# EAGLE design STM32F446ZEJx-SW308-UFO V1.0 (EAGLE 9.6.2)
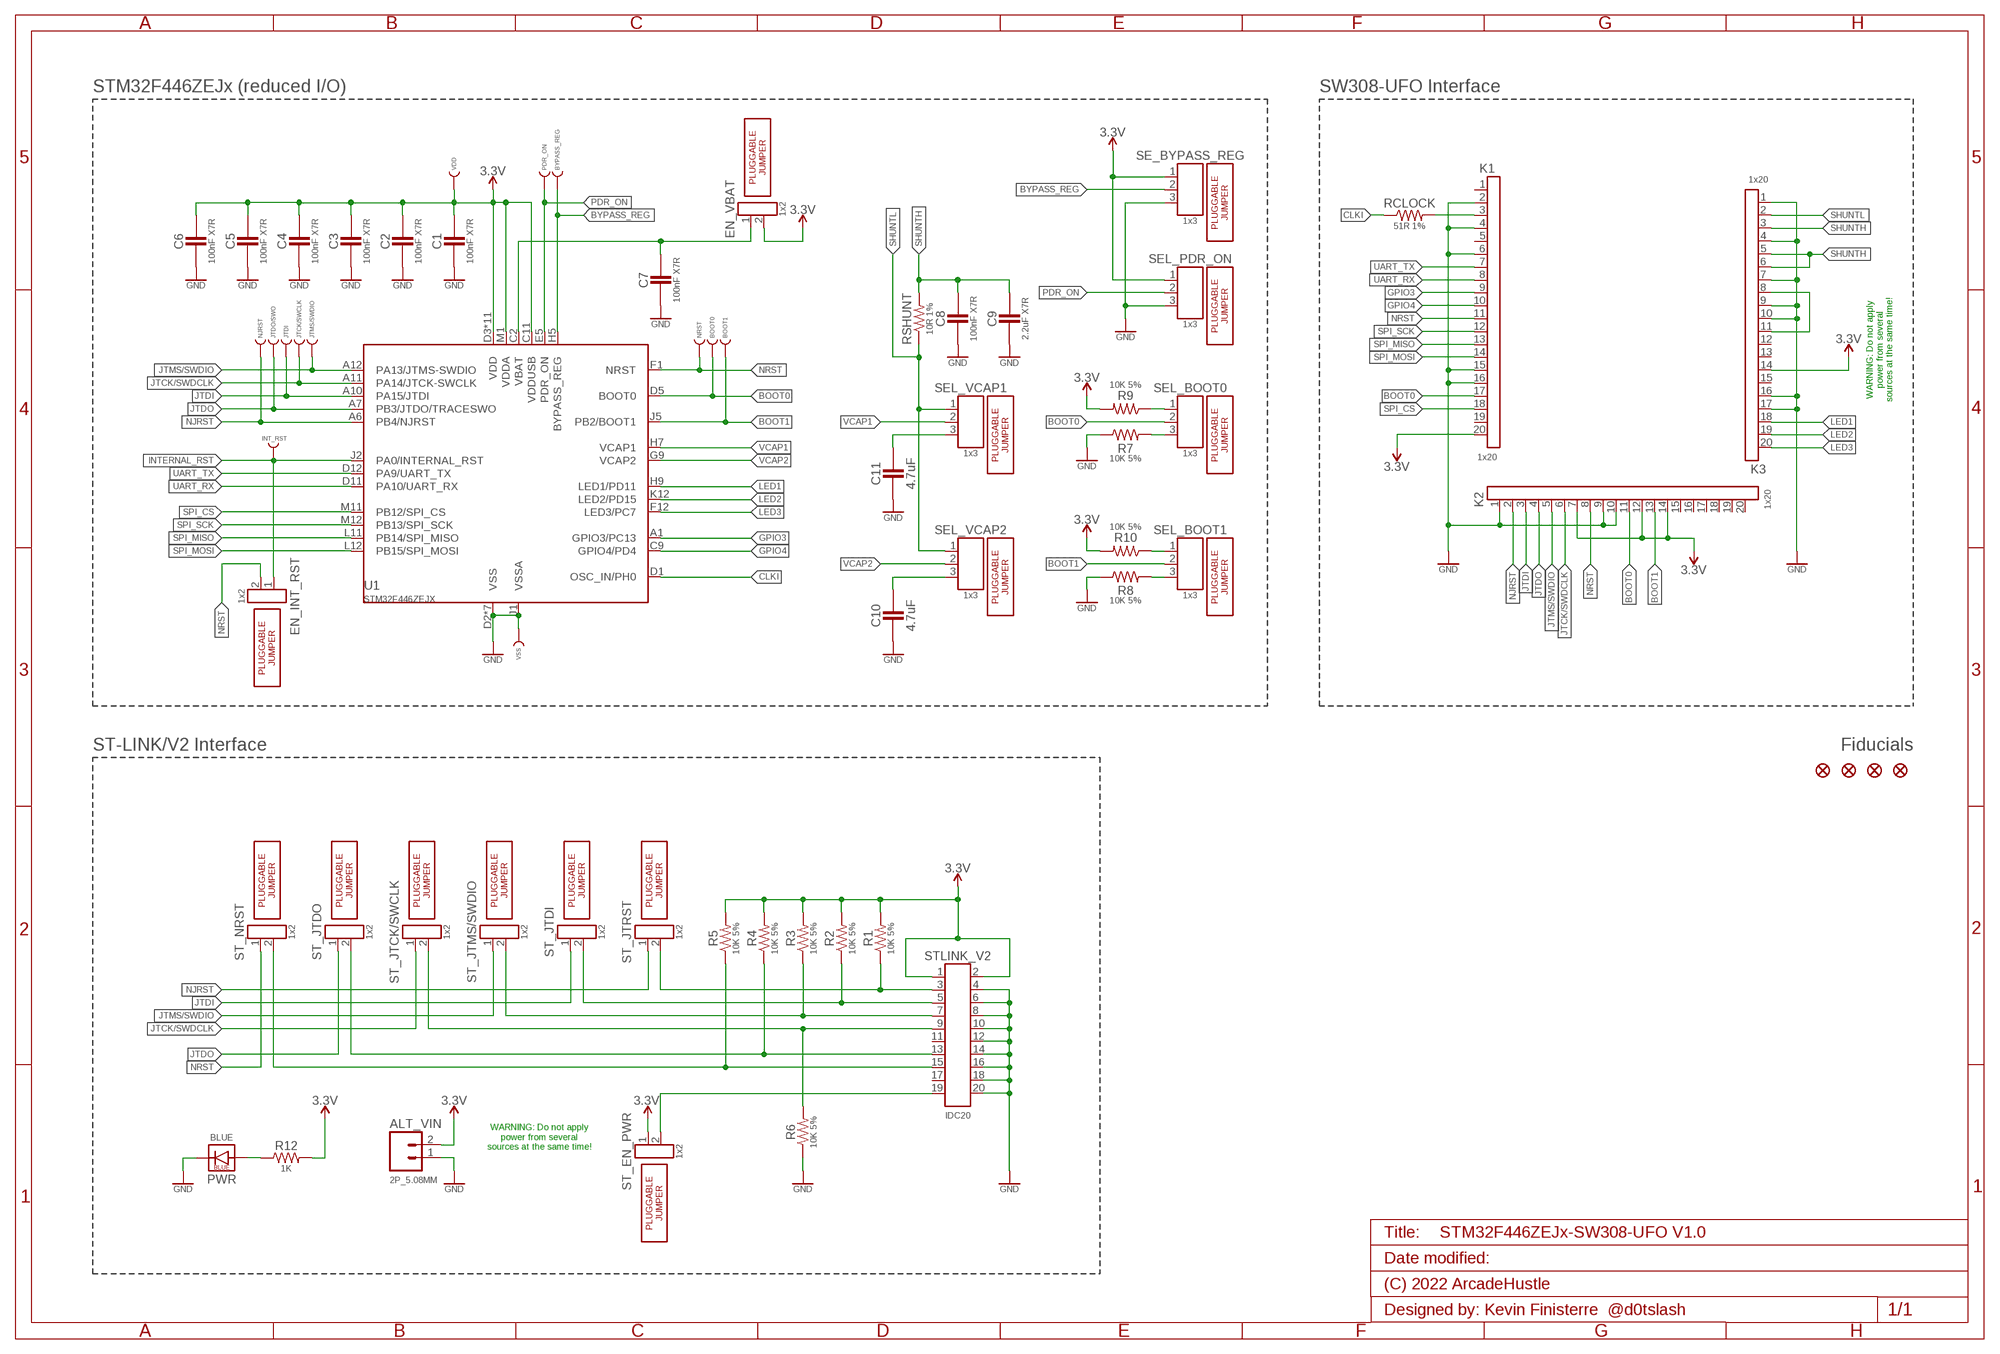
[diagram p0: schematic, sheet 1]

## Parts
ALT_VIN  2P_5.08MM  M02_BORNA_2X5.08MM_NINGBO-KANGNEX-ELEC_WJ500V-5.08-2P  [BORNA_2X5.08MM_NINGBO-KANGNEX-ELEC_WJ500V-5.08-2P]
BOOT0  TESTPOINT_TH_0.8MM  [1X01]
BOOT1  TESTPOINT_TH_0.8MM  [1X01]
BYPASS_REG  TESTPOINT_TH_0.8MM  [1X01]
C1  100nF X7R  CAP__0603_IPC_NOMINAL  [0603_IPC_NOMINAL]
C2  100nF X7R  CAP__0603_IPC_NOMINAL  [0603_IPC_NOMINAL]
C3  100nF X7R  CAP__0603_IPC_NOMINAL  [0603_IPC_NOMINAL]
C4  100nF X7R  CAP__0603_IPC_NOMINAL  [0603_IPC_NOMINAL]
C5  100nF X7R  CAP__0603_IPC_NOMINAL  [0603_IPC_NOMINAL]
C6  100nF X7R  CAP__0603_IPC_NOMINAL  [0603_IPC_NOMINAL]
C7  100nF X7R  CAP__0603_IPC_NOMINAL  [0603_IPC_NOMINAL]
C8  100nF X7R  CAP__0603_IPC_NOMINAL  [0603_IPC_NOMINAL]
C9  2.2uF X7R  CAP__0603_IPC_NOMINAL  [0603_IPC_NOMINAL]
C10  4.7uF  CAP__0603_IPC_NOMINAL  [0603_IPC_NOMINAL]
C11  4.7uF  CAP__0603_IPC_NOMINAL  [0603_IPC_NOMINAL]
EN_INT_RST  1x2  M1X2_GREENCONN_GPHA101-0201A001A1BA(A=6,B=3)_ALT_PADS  [M1X2_GREENCONN_GPHA101-0201A001A1BA(A=6,B=3)_ALT_PADS]
EN_VBAT  1x2  M1X2_GREENCONN_GPHA101-0201A001A1BA(A=6,B=3)_ALT_PADS  [M1X2_GREENCONN_GPHA101-0201A001A1BA(A=6,B=3)_ALT_PADS]
FD1  FIDUCIAL_MICRO  [FIDUCIAL-MICRO]
FD5  FIDUCIAL_MICRO  [FIDUCIAL-MICRO]
FD7  FIDUCIAL_MICRO  [FIDUCIAL-MICRO]
FD9  FIDUCIAL_MICRO  [FIDUCIAL-MICRO]
INT_RST  TESTPOINT_TH_0.8MM  [1X01]
JTCK/SWCLK  TESTPOINT_TH_0.8MM  [1X01]
JTDI  TESTPOINT_TH_0.8MM  [1X01]
JTDO/SWO  TESTPOINT_TH_0.8MM  [1X01]
JTMS/SWDIO  TESTPOINT_TH_0.8MM  [1X01]
JUMPER1  JUMPER_2.54MM  [JUMPER_2.54MM]
JUMPER2  JUMPER_2.54MM  [JUMPER_2.54MM]
JUMPER3  JUMPER_2.54MM  [JUMPER_2.54MM]
JUMPER4  JUMPER_2.54MM  [JUMPER_2.54MM]
JUMPER5  JUMPER_2.54MM  [JUMPER_2.54MM]
JUMPER6  JUMPER_2.54MM  [JUMPER_2.54MM]
JUMPER7  JUMPER_2.54MM  [JUMPER_2.54MM]
JUMPER8  JUMPER_2.54MM  [JUMPER_2.54MM]
JUMPER9  JUMPER_2.54MM  [JUMPER_2.54MM]
JUMPER10  JUMPER_2.54MM  [JUMPER_2.54MM]
JUMPER11  JUMPER_2.54MM  [JUMPER_2.54MM]
JUMPER12  JUMPER_2.54MM  [JUMPER_2.54MM]
JUMPER13  JUMPER_2.54MM  [JUMPER_2.54MM]
JUMPER14  JUMPER_2.54MM  [JUMPER_2.54MM]
JUMPER15  JUMPER_2.54MM  [JUMPER_2.54MM]
K1  1x20  M1X20_2.54MM_LOCK_BOOMELE_C50981  [M1X20_2.54MM_LOCK_BOOMELE_C50981]
K2  1x20  M1X20_2.54MM_LOCK_BOOMELE_C50981  [M1X20_2.54MM_LOCK_BOOMELE_C50981]
K3  1x20  M1X20_2.54MM_LOCK_BOOMELE_C50981  [M1X20_2.54MM_LOCK_BOOMELE_C50981]
NJRST  TESTPOINT_TH_0.8MM  [1X01]
NRST  TESTPOINT_TH_0.8MM  [1X01]
PDR_ON  TESTPOINT_TH_0.8MM  [1X01]
PWR  BLUE  DIODE-BLUE_0603  [0603-BLUE-LED]
R1  10K 5%  R_US_0603_IPC_NOMINAL  [0603_IPC_NOMINAL]
R2  10K 5%  R_US_0603_IPC_NOMINAL  [0603_IPC_NOMINAL]
R3  10K 5%  R_US_0603_IPC_NOMINAL  [0603_IPC_NOMINAL]
R4  10K 5%  R_US_0603_IPC_NOMINAL  [0603_IPC_NOMINAL]
R5  10K 5%  R_US_0603_IPC_NOMINAL  [0603_IPC_NOMINAL]
R6  10K 5%  R_US_0603_IPC_NOMINAL  [0603_IPC_NOMINAL]
R7  10K 5%  R_US_0603_IPC_NOMINAL  [0603_IPC_NOMINAL]
R8  10K 5%  R_US_0603_IPC_NOMINAL  [0603_IPC_NOMINAL]
R9  10K 5%  R_US_0603_IPC_NOMINAL  [0603_IPC_NOMINAL]
R10  10K 5%  R_US_0603_IPC_NOMINAL  [0603_IPC_NOMINAL]
R12  1K  R_US_0603_IPC_NOMINAL  [0603_IPC_NOMINAL]
RCLOCK  51R 1%  R_US_0603_IPC_NOMINAL  [0603_IPC_NOMINAL]
RSHUNT  10R 1%  R_US_0603_IPC_NOMINAL  [0603_IPC_NOMINAL]
SE_BYPASS_REG  1x3  M3_GREENCONN_GPHA101-0301A001A1BA(A=6,B=3)_ALT_PADS  [M1X3_GREENCONN_GPHA101-0301A001A1BA(A=6,B=3)_ALT_PADS]
SEL_BOOT0  1x3  M3_GREENCONN_GPHA101-0301A001A1BA(A=6,B=3)_ALT_PADS  [M1X3_GREENCONN_GPHA101-0301A001A1BA(A=6,B=3)_ALT_PADS]
SEL_BOOT1  1x3  M3_GREENCONN_GPHA101-0301A001A1BA(A=6,B=3)_ALT_PADS  [M1X3_GREENCONN_GPHA101-0301A001A1BA(A=6,B=3)_ALT_PADS]
SEL_PDR_ON  1x3  M3_GREENCONN_GPHA101-0301A001A1BA(A=6,B=3)_ALT_PADS  [M1X3_GREENCONN_GPHA101-0301A001A1BA(A=6,B=3)_ALT_PADS]
SEL_VCAP1  1x3  M3_GREENCONN_GPHA101-0301A001A1BA(A=6,B=3)_ALT_PADS  [M1X3_GREENCONN_GPHA101-0301A001A1BA(A=6,B=3)_ALT_PADS]
SEL_VCAP2  1x3  M3_GREENCONN_GPHA101-0301A001A1BA(A=6,B=3)_ALT_PADS  [M1X3_GREENCONN_GPHA101-0301A001A1BA(A=6,B=3)_ALT_PADS]
ST_EN_PWR  1x2  M1X2_GREENCONN_GPHA101-0201A001A1BA(A=6,B=3)_ALT_PADS  [M1X2_GREENCONN_GPHA101-0201A001A1BA(A=6,B=3)_ALT_PADS]
ST_JTCK/SWCLK  1x2  M1X2_GREENCONN_GPHA101-0201A001A1BA(A=6,B=3)_ALT_PADS  [M1X2_GREENCONN_GPHA101-0201A001A1BA(A=6,B=3)_ALT_PADS]
ST_JTDI  1x2  M1X2_GREENCONN_GPHA101-0201A001A1BA(A=6,B=3)_ALT_PADS  [M1X2_GREENCONN_GPHA101-0201A001A1BA(A=6,B=3)_ALT_PADS]
ST_JTDO  1x2  M1X2_GREENCONN_GPHA101-0201A001A1BA(A=6,B=3)_ALT_PADS  [M1X2_GREENCONN_GPHA101-0201A001A1BA(A=6,B=3)_ALT_PADS]
ST_JTMS/SWDIO  1x2  M1X2_GREENCONN_GPHA101-0201A001A1BA(A=6,B=3)_ALT_PADS  [M1X2_GREENCONN_GPHA101-0201A001A1BA(A=6,B=3)_ALT_PADS]
ST_JTRST  1x2  M1X2_GREENCONN_GPHA101-0201A001A1BA(A=6,B=3)_ALT_PADS  [M1X2_GREENCONN_GPHA101-0201A001A1BA(A=6,B=3)_ALT_PADS]
ST_NRST  1x2  M1X2_GREENCONN_GPHA101-0201A001A1BA(A=6,B=3)_ALT_PADS  [M1X2_GREENCONN_GPHA101-0201A001A1BA(A=6,B=3)_ALT_PADS]
STLINK_V2  IDC20  M2X10_2.54MM_IDC_SHROUDED__JLIN_321020SG0ABK00A01_C429961  [M2X10_2.54MM_IDC_SHROUDED__JLIN_321020SG0ABK00A01_C429961]
U1  STM32F446ZEJX  STM32F446ZEJX_MINIMUM2_UFBGA144  [STM32F446ZEJX]
VDD  TESTPOINT_TH_0.8MM  [1X01]
VSS  TESTPOINT_TH_0.8MM  [1X01]

## Nets
3.3V: ALT_VIN.2 C1.1 C2.1 C3.1 C4.1 C5.1 C6.1 EN_VBAT.2 K1.20 K2.7 K2.12 K2.14 K3.14 R1.2 R2.2 R3.2 R4.2 R5.2 R9.2 R10.2 R12.2 SE_BYPASS_REG.1 SEL_PDR_ON.1 ST_EN_PWR.1 STLINK_V2.1 STLINK_V2.2 U1.C11(VDDUSB) U1.D3(VDD) U1.F4(VDD) U1.F5(VDD) U1.F6(VDD) U1.F7(VDD) U1.F8(VDD) U1.F9(VDD) U1.F10(VDD) U1.G5(VDD) U1.G6(VDD) U1.G7(VDD) U1.M1(VDDA) VDD.1
BOOT0: BOOT0.1 K1.17 K2.11 SEL_BOOT0.2 U1.D5(BOOT0)
BOOT1: BOOT1.1 K2.13 SEL_BOOT1.2 U1.J5(PB2/BOOT1)
BYPASS_REG: BYPASS_REG.1 SE_BYPASS_REG.2 U1.H5(BYPASS_REG)
CLKI: RCLOCK.1 U1.D1(OSC_IN/PH0)
GND: ALT_VIN.1 C1.2 C2.2 C3.2 C4.2 C5.2 C6.2 C7.2 C8.2 C9.2 C10.2 C11.2 K1.2 K1.4 K1.6 K1.15 K1.16 K2.1 K2.9 K2.10 K3.1 K3.4 K3.7 K3.9 K3.10 K3.16 K3.17 PWR.CATHODE(C) R6.1 R7.1 R8.1 SE_BYPASS_REG.3 SEL_PDR_ON.3 STLINK_V2.4 STLINK_V2.6 STLINK_V2.8 STLINK_V2.10 STLINK_V2.12 STLINK_V2.14 STLINK_V2.16 STLINK_V2.18 STLINK_V2.20 U1.D2(VSS) U1.E6(VSS) U1.E7(VSS) U1.G4(VSS) U1.G8(VSS) U1.G10(VSS) U1.H6(VSS) U1.J1(VSSA) VSS.1
GPIO3: K1.9 U1.A1(GPIO3/PC13)
GPIO4: K1.10 U1.C9(GPIO4/PD4)
INTERNAL_RST: EN_INT_RST.1 INT_RST.1 U1.J2(PA0/INTERNAL_RST)
JTCK/SWDCLK: JTCK/SWCLK.1 K2.6 ST_JTCK/SWCLK.1 U1.A11(PA14/JTCK-SWCLK)
JTDI: JTDI.1 K2.3 ST_JTDI.1 U1.A10(PA15/JTDI)
JTDO: JTDO/SWO.1 K2.4 ST_JTDO.1 U1.A7(PB3/JTDO/TRACESWO)
JTMS/SWDIO: JTMS/SWDIO.1 K2.5 ST_JTMS/SWDIO.1 U1.A12(PA13/JTMS-SWDIO)
LED1: K3.18 U1.H9(LED1/PD11)
LED2: K3.19 U1.K12(LED2/PD15)
LED3: K3.20 U1.F12(LED3/PC7)
N$1: R2.1 ST_JTDI.2 STLINK_V2.5
N$2: C7.1 EN_VBAT.1 U1.C2(VBAT)
N$3: PWR.ANODE(A) R12.1
N$4: R3.1 ST_JTMS/SWDIO.2 STLINK_V2.7
N$5: C10.1 SEL_VCAP2.3
N$6: R1.1 ST_JTRST.2 STLINK_V2.3
N$7: R6.2 ST_JTCK/SWCLK.2 STLINK_V2.9
N$8: R7.2 SEL_BOOT0.3
N$9: R4.1 ST_JTDO.2 STLINK_V2.13
N$10: R10.1 SEL_BOOT1.1
N$11: R5.1 ST_NRST.2 STLINK_V2.15
N$12: R8.2 SEL_BOOT1.3
N$13: ST_EN_PWR.2 STLINK_V2.19
N$14: C11.1 SEL_VCAP1.3
N$15: R9.1 SEL_BOOT0.1
N$18: K3.8 K3.11
N$19: K1.3 RCLOCK.2
NJRST: K2.2 NJRST.1 ST_JTRST.1 U1.A6(PB4/NJRST)
NRST: EN_INT_RST.2 K1.11 K2.8 NRST.1 ST_NRST.1 U1.F1(NRST)
PDR_ON: PDR_ON.1 SEL_PDR_ON.2 U1.E5(PDR_ON)
SHUNTH: C8.1 C9.1 K3.3 K3.5 K3.6 RSHUNT.2
SHUNTL: K3.2 RSHUNT.1 SEL_VCAP1.1 SEL_VCAP2.1
SPI_CS: K1.18 U1.M11(PB12/SPI_CS)
SPI_MISO: K1.13 U1.L11(PB14/SPI_MISO)
SPI_MOSI: K1.14 U1.L12(PB15/SPI_MOSI)
SPI_SCK: K1.12 U1.M12(PB13/SPI_SCK)
UART_RX: K1.8 U1.D11(PA10/UART_RX)
UART_TX: K1.7 U1.D12(PA9/UART_TX)
VCAP1: SEL_VCAP1.2 U1.H7(VCAP1)
VCAP2: SEL_VCAP2.2 U1.G9(VCAP2)
Unconnected: K1.1 K1.5 K1.19 K2.15 K2.16 K2.17 K2.18 K2.19 K2.20 K3.12 K3.13 K3.15 STLINK_V2.11 STLINK_V2.17

## Notes on the sheet
- STM32F446ZEJx (reduced I/O) | SW308-UFO Interface
- WARNING: Do not apply
  power from several
  sources at the same time!
- ST-LINK/V2 Interface | Fiducials
- WARNING: Do not apply
  power from several
  sources at the same time!

## Library data of the parts
ALT_VIN = ArcadeHustle:M02; ALT_LCSC_PN: C8269; ALT_MANUFACTURER: Ningbo Kangnex Elec; ALT_PN: WJ128V-5.0-2P; LCSC_PN: C8465; MANUFACTURER: Ningbo Kangnex Elec; PN: WJ500V-5.08-2P
BOOT0 BOOT1 BYPASS_REG INT_RST JTCK/SWCLK JTDI JTDO/SWO JTMS/SWDIO NJRST NRST PDR_ON VDD VSS = ArcadeHustle:TESTPOINT
C1-C8 = ArcadeHustle:CAP_; LCSC_PN: C1591; MANUFACTURER: Samsung Electro-Mechanics; PN: CL10B104KB8NNNC
C9 = ArcadeHustle:CAP_; LCSC_PN: C100082; MANUFACTURER: Samsung Electro-Mechanics; PN: CL10B225KP8NNNC
C10 C11 = ArcadeHustle:CAP_; LCSC_PN: C8032; MANUFACTURER: Samsung Electro-Mechanics; PN: CL10A475KQ8NNNC
EN_INT_RST EN_VBAT ST_EN_PWR ST_JTCK/SWCLK ST_JTDI ST_JTDO ST_JTMS/SWDIO ST_JTRST ST_NRST = ArcadeHustle:M1X2; ALT_LCSC_PN: -; ALT_MANUFACTURER: GREENCONN; ALT_PN: GPHA101-0201A001A1BA(A=6,B=3); LCSC_PN: C124375; MANUFACTURER: Ckmtw(Shenzhen Cankemeng); PN: C124375
FD1 FD5 FD7 FD9 = ArcadeHustle:FIDUCIAL
JUMPER1-JUMPER15 = ArcadeHustle:JUMPER; LCSC_PN: C5305; MANUFACTURER: BOOMELE(Boom Precision Elec); PN: C5305
K1-K3 = ArcadeHustle:M1X20; LCSC_PN: C50981; MANUFACTURER: BOOMELE(Boom Precision Elec); PN: C50981
PWR = ArcadeHustle:DIODE-BLUE; LCSC_PN: C72041; MANUFACTURER: Everlight Elec; PN: 19-217/BHC-ZL1M2RY/3T
R1-R10 = ArcadeHustle:R_US_; LCSC_PN: C99198; MANUFACTURER: YAGEO; PN: RC0603JR-0710KL
R12 = ArcadeHustle:R_US_; LCSC_PN: C22548; MANUFACTURER: YAGEO; PN: RC0603FR-071KL
RCLOCK = ArcadeHustle:R_US_; LCSC_PN: C114628; MANUFACTURER: YAGEO; PN: RC0603FR-0751RL
RSHUNT = ArcadeHustle:R_US_; LCSC_PN: C109318; MANUFACTURER: YAGEO; PN: RC0603FR-0710RL
SE_BYPASS_REG SEL_BOOT0 SEL_BOOT1 SEL_PDR_ON SEL_VCAP1 SEL_VCAP2 = ArcadeHustle:M3; ALT_LCSC_PN: -; ALT_MANUFACTURER: GREENCONN; ALT_PN: GPHA101-0301A001A1BA(A=6,B=3); LCSC_PN: C49257; MANUFACTURER: BOOMELE(Boom Precision Elec); PN: C49257
STLINK_V2 = ArcadeHustle:M2X10; ALT2_LCSC_PN: -; ALT2_MANUFACTURER: GREENCONN; ALT2_PN: GPHA204-1001A001A1SB(B=3); ALT_LCSC_PN: C19694; ALT_MANUFACTURER: BOOMELE(Boom Precision Elec); ALT_PN: C19694; LCSC_PN: C429961; MANUFACTURER: JLIN; PN: 321020SG0ABK00A01
U1 = ArcadeHustle:STM32F446ZEJX_MINIMUM2

## Net classes
0 default_50R_L1-L2: width 0.089 mm, drill 0.2 mm, clearance 0.114 mm
1 PWR: width 0.3 mm, drill 0.2 mm, clearance 0.114 mm
2 MICROSTRIP_50R_L1-L2: width 0.147 mm, drill 0.2 mm, clearance 0.147 mm to class 0, clearance 0.147 mm to class 1, clearance 0.147 mm
3 MICROSTRIP_90R-DIFF_S1=8mils_L1-L2: width 0.153 mm, drill 0.2 mm, clearance 0.203 mm
4 COPLANAR_WAVEGUIDE_LINE_50R-L1-L3: width 0.8 mm, drill 0.2 mm, clearance 0.176 mm to class 0, clearance 0.176 mm to class 1
5 MICROSTRIP_90R-DIFF_S1=5mils_L1-L2: width 0.131 mm, drill 0.2 mm, clearance 0.305 mm to class 0, clearance 0.305 mm to class 1, clearance 0.127 mm

## Board
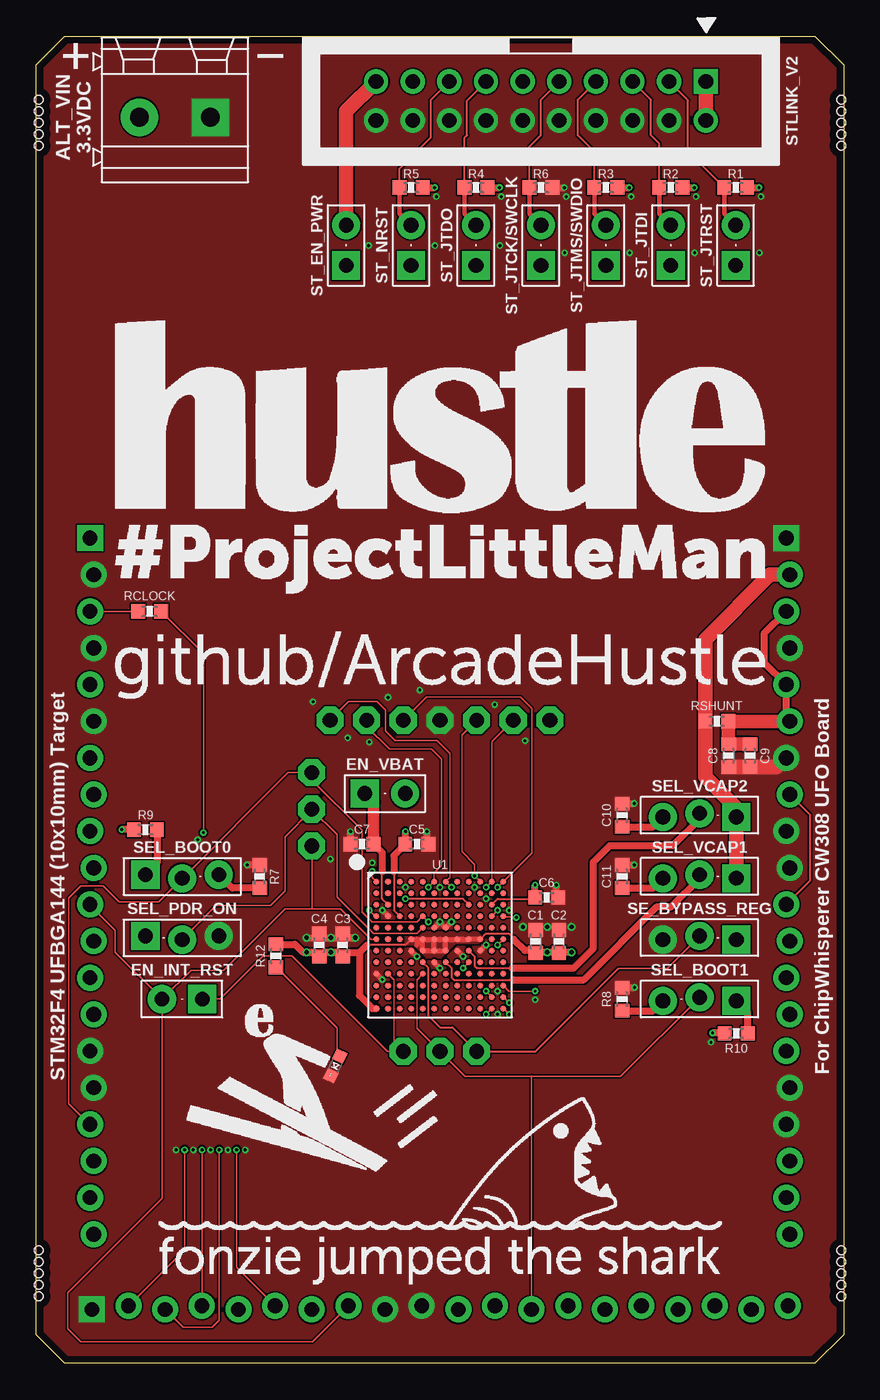
[diagram p1: board, top side]
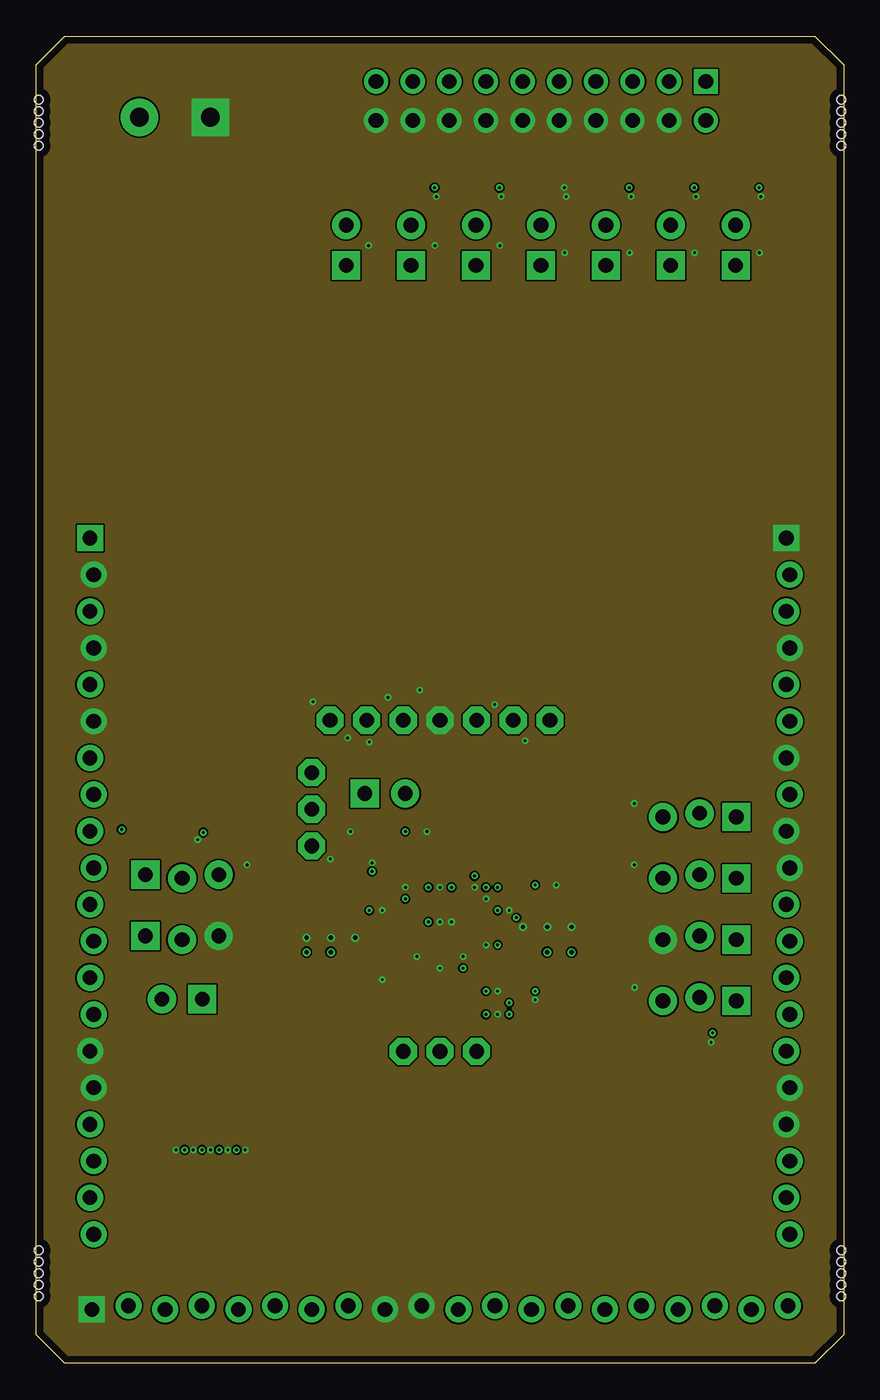
[diagram p2: board, inner layer GND1]
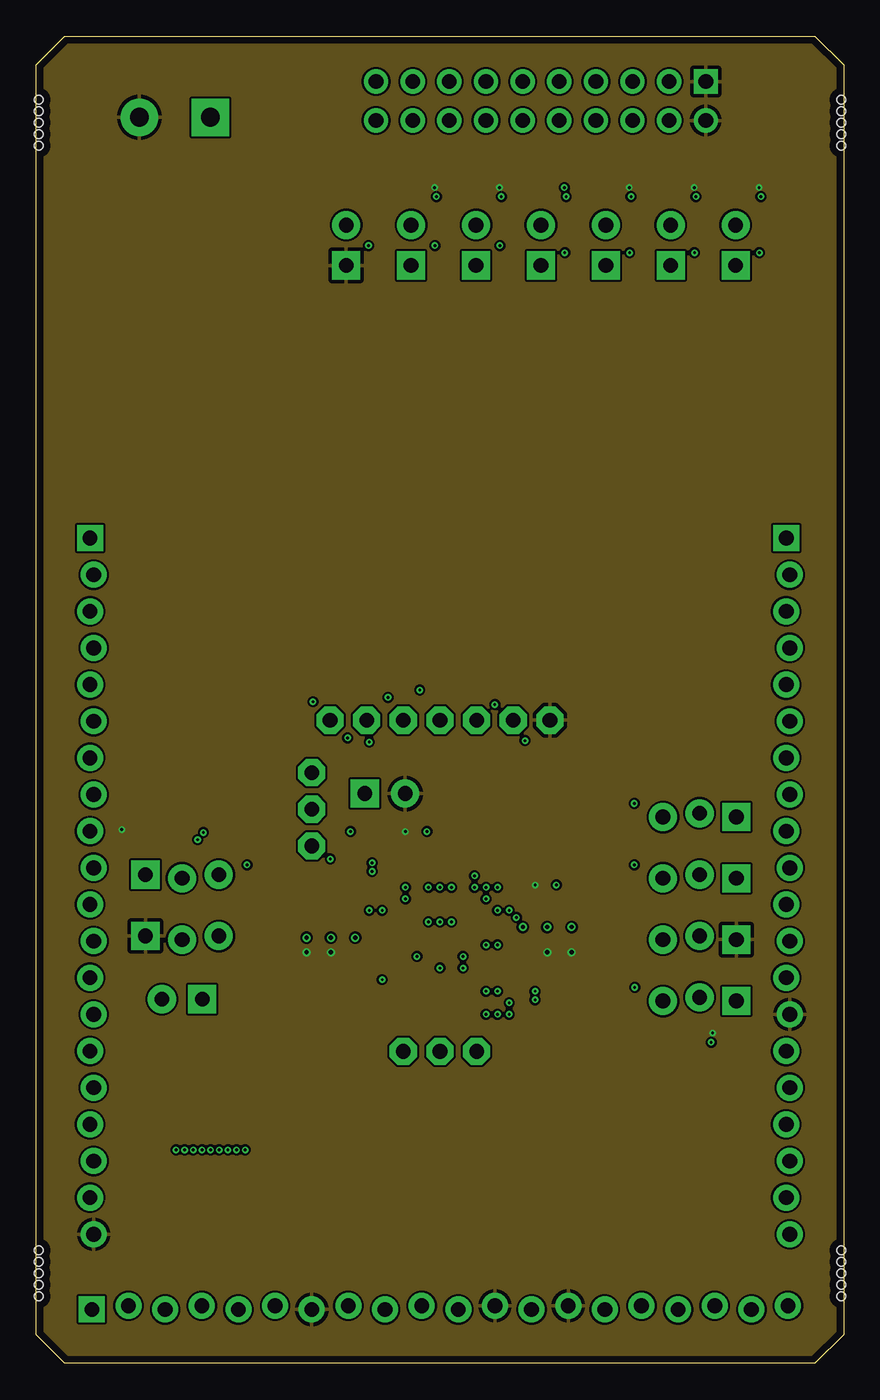
[diagram p3: board, inner layer PWR]
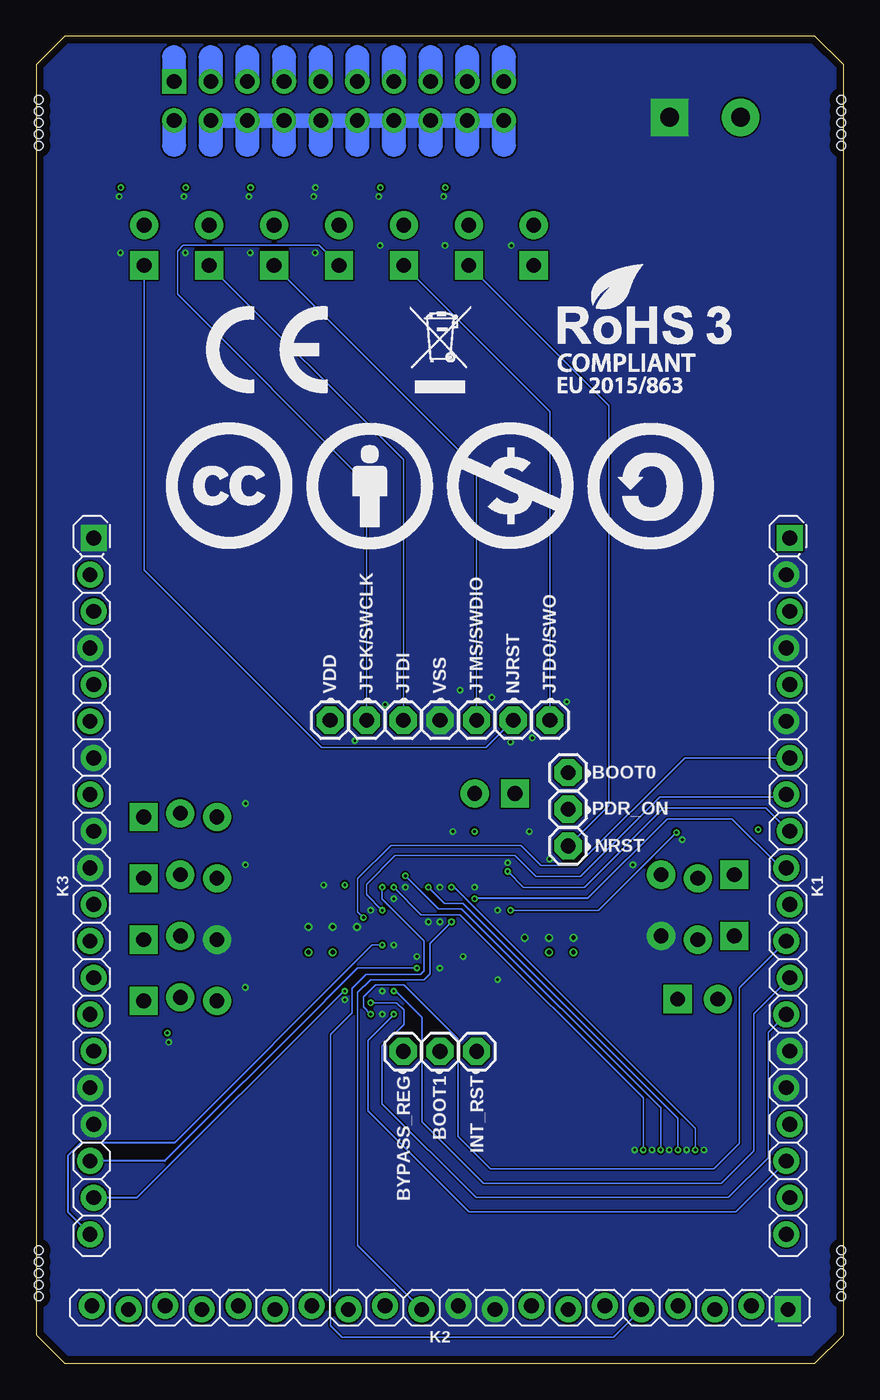
[diagram p4: board, bottom side, seen from below]

Size 56 x 92 mm. Coordinates in mm from the lower left corner, seen from the top.
Outline: 2,0 0,2 0,90 2,92 54,92 56,90 56,2 54,0 2,0
Copper layers (1+2*15+16): TOP(SIGNAL) 0.035mm / dielectric 0.1mm / GND1 0.0175mm / dielectric 1.295mm / PWR 0.0175mm / dielectric 0.1mm / BOTTOM(SIGNAL) 0.035mm
Design rules "7IX_SDRAM_128MB v1.1 *": minimum track width 3.5mil, minimum drill 0.2mm, track to track 4.5mil, track to pad 4.5mil, pad to pad 4.5mil, via to via 4.5mil, smd to smd 4.5mil, copper to edge 0.5mm, drill to drill 8mil, minimum pad ring 5mil, minimum via ring 5mil, stop-mask expansion 1mil, vias tented up to drill 0.3mm, thermal gap 10mil
Holes 3.13 mm at -4.5,6 60.5,6 60.5,86 -4.5,86
Holes 0.6 mm at 0.19,86 0.19,85.2 0.19,84.4 0.19,86.8 0.19,87.6 0.19,6.25 0.19,5.45 0.19,4.65 0.19,7.05 0.19,7.85 55.81,86 55.81,85.2 55.81,84.4 55.81,86.8 55.81,87.6 55.81,6.25 55.81,5.45 55.81,4.65 55.81,7.05 55.81,7.85

### Footprints (pad centres in the part's own frame; a part is rotated, then mirrored left to right if it is on the bottom)
BORNA_2X5.08MM_NINGBO-KANGNEX-ELEC_WJ500V-5.08-2P = drill 1.3 pad 2.6 square: 1 -2.46,0 | drill 1.3 pad 2.6: 2 2.46,0
1X01 = drill 1.016 pad 1.88 octagon: 1 0,0
0603_IPC_NOMINAL = smd 0.95 x 1: 1 -0.8,0; 2 0.8,0
M1X2_GREENCONN_GPHA101-0201A001A1BA(A=6,B=3)_ALT_PADS = drill 1.02 pad 1.95 square: 1 -1.397,0 | drill 1.02 pad 1.95: 2 1.397,0
FIDUCIAL-MICRO = smd 0.635 x 0.635: 1 0,0
M1X20_2.54MM_LOCK_BOOMELE_C50981 = drill 1.02 pad 1.8 square: 1 -24.13,0.127 | drill 1.02 pad 1.8: 2 -21.59,-0.127; 3 -19.05,0.127; 4 -16.51,-0.127; 5 -13.97,0.127; 6 -11.43,-0.127; 7 -8.89,0.127; 8 -6.35,-0.127; 9 -3.81,0.127; 10 -1.27,-0.127; 11 1.27,0.127; 12 3.81,-0.127; 13 6.35,0.127; 14 8.89,-0.127; 15 11.43,0.127; 16 13.97,-0.127; 17 16.51,0.127; 18 19.05,-0.127; 19 21.59,0.127; 20 24.13,-0.127
0603-BLUE-LED = smd 0.8 x 0.8: ANODE -0.75,0; CATHODE 0.75,0
M1X3_GREENCONN_GPHA101-0301A001A1BA(A=6,B=3)_ALT_PADS = drill 1.02 pad 1.95 square: 1 -2.54,0.127 | drill 1.02 pad 1.95: 2 0,-0.127; 3 2.54,0.127
M2X10_2.54MM_IDC_SHROUDED__JLIN_321020SG0ABK00A01_C429961 = drill 1.016 pad 1.676 square: 1 -11.43,-1.35 | drill 1.016 pad 1.676: 2 -11.43,1.35; 3 -8.89,-1.35; 4 -8.89,1.35; 5 -6.35,-1.35; 6 -6.35,1.35; 7 -3.81,-1.35; 8 -3.81,1.35; 9 -1.27,-1.35; 10 -1.27,1.35; 11 1.27,-1.35; 12 1.27,1.35; 13 3.81,-1.35; 14 3.81,1.35; 15 6.35,-1.35; 16 6.35,1.35; 17 8.89,-1.35; 18 8.89,1.35; 19 11.43,-1.35; 20 11.43,1.35
STM32F446ZEJX = smd 0.4 x 0.4: A1 -4.4,4.4; A2 -3.6,4.4; A3 -2.8,4.4; A4 -2,4.4; A5 -1.2,4.4; A6 -0.4,4.4; A7 0.4,4.4; A8 1.2,4.4; A9 2,4.4; A10 2.8,4.4; A11 3.6,4.4; A12 4.4,4.4; B1 -4.4,3.6; B2 -3.6,3.6; B3 -2.8,3.6; B4 -2,3.6; B5 -1.2,3.6; B6 -0.4,3.6; B7 0.4,3.6; B8 1.2,3.6; B9 2,3.6; B10 2.8,3.6; B11 3.6,3.6; B12 4.4,3.6; C1 -4.4,2.8; C2 -3.6,2.8; C3 -2.8,2.8; C4 -2,2.8; C5 -1.2,2.8; C6 -0.4,2.8; C7 0.4,2.8; C8 1.2,2.8; C9 2,2.8; C10 2.8,2.8; C11 3.6,2.8; C12 4.4,2.8; D1 -4.4,2; D2 -3.6,2; D3 -2.8,2; D4 -2,2; D5 -1.2,2; D6 -0.4,2; D7 0.4,2; D8 1.2,2; D9 2,2; D10 2.8,2; D11 3.6,2; D12 4.4,2; E1 -4.4,1.2; E2 -3.6,1.2; E3 -2.8,1.2; E4 -2,1.2; E5 -1.2,1.2; E6 -0.4,1.2; E7 0.4,1.2; E8 1.2,1.2; E9 2,1.2; E10 2.8,1.2; E11 3.6,1.2; E12 4.4,1.2; F1 -4.4,0.4; F2 -3.6,0.4; F3 -2.8,0.4; F4 -2,0.4; F5 -1.2,0.4; F6 -0.4,0.4; F7 0.4,0.4; F8 1.2,0.4; F9 2,0.4; F10 2.8,0.4; F11 3.6,0.4; F12 4.4,0.4; G1 -4.4,-0.4; G2 -3.6,-0.4; G3 -2.8,-0.4; G4 -2,-0.4; G5 -1.2,-0.4; G6 -0.4,-0.4; G7 0.4,-0.4; G8 1.2,-0.4; G9 2,-0.4; G10 2.8,-0.4; G11 3.6,-0.4; G12 4.4,-0.4; H1 -4.4,-1.2; H2 -3.6,-1.2; H3 -2.8,-1.2; H4 -2,-1.2; H5 -1.2,-1.2; H6 -0.4,-1.2; H7 0.4,-1.2; H8 1.2,-1.2; H9 2,-1.2; H10 2.8,-1.2; H11 3.6,-1.2; H12 4.4,-1.2; J1 -4.4,-2; J2 -3.6,-2; J3 -2.8,-2; J4 -2,-2; J5 -1.2,-2; J6 -0.4,-2; J7 0.4,-2; J8 1.2,-2; J9 2,-2; J10 2.8,-2; J11 3.6,-2; J12 4.4,-2; K1 -4.4,-2.8; K2 -3.6,-2.8; K3 -2.8,-2.8; K4 -2,-2.8; K5 -1.2,-2.8; K6 -0.4,-2.8; K7 0.4,-2.8; K8 1.2,-2.8; K9 2,-2.8; K10 2.8,-2.8; K11 3.6,-2.8; K12 4.4,-2.8; L1 -4.4,-3.6; L2 -3.6,-3.6; L3 -2.8,-3.6; L4 -2,-3.6; L5 -1.2,-3.6; L6 -0.4,-3.6; L7 0.4,-3.6; L8 1.2,-3.6; L9 2,-3.6; L10 2.8,-3.6; L11 3.6,-3.6; L12 4.4,-3.6; M1 -4.4,-4.4; M2 -3.6,-4.4; M3 -2.8,-4.4; M4 -2,-4.4; M5 -1.2,-4.4; M6 -0.4,-4.4; M7 0.4,-4.4; M8 1.2,-4.4; M9 2,-4.4; M10 2.8,-4.4; M11 3.6,-4.4; M12 4.4,-4.4

### Placement (x,y rotation side)
ALT_VIN  9.62,86.38 180 top
BOOT0  19.11,40.95 180 bottom
BOOT1  28,21.62 90 bottom
BYPASS_REG  30.54,21.62 90 bottom
C1  34.62,29.25 90 top
C2  36.25,29.25 90 top
C3  21.25,29 90 top
C4  19.62,29 90 top
C5  26.4,36 0 top
C6  35.4,32.3 0 top
C7  22.6,36 180 top
C8  48,42.12 270 top
C9  49.5,42.12 270 top
C10  40.62,38 90 top
C11  40.62,33.75 90 top
EN_INT_RST  10.12,25.25 180 top
EN_VBAT  24.19,39.5 0 top
FD1  -4.5,82 0 top  (outside the outline)
FD5  -4.5,10 0 top  (outside the outline)
FD7  60.5,10 0 top  (outside the outline)
FD9  60.5,82 0 top  (outside the outline)
INT_RST  25.46,21.62 90 bottom
JTCK/SWCLK  33.08,44.58 270 bottom
JTDI  30.54,44.58 270 bottom
JTDO/SWO  20.38,44.58 270 bottom
JTMS/SWDIO  25.46,44.58 270 bottom
JUMPER1  21.5,77.5 90 top
JUMPER2  26,77.5 90 top
JUMPER3  30.5,77.5 90 top
JUMPER4  35,77.5 90 top
JUMPER5  39.5,77.5 270 top
JUMPER6  44,77.5 90 top
JUMPER7  48.5,77.5 90 top
JUMPER8  47.27,29.5 180 top
JUMPER9  10.12,25.25 0 top
JUMPER10  8.86,29.5 0 top
JUMPER11  47.27,33.75 180 top
JUMPER12  44.73,25.25 0 top
JUMPER13  47.27,38 0 top
JUMPER14  11.39,33.75 0 top
JUMPER15  24.19,39.5 0 top
K1  3.87,33.08 270 bottom
K2  28,3.87 180 bottom
K3  52.13,33.08 270 bottom
NJRST  22.92,44.58 270 bottom
NRST  19.11,35.87 180 bottom
PDR_ON  19.11,38.41 180 bottom
PWR  20.75,20.62 245 top
R1  48.5,81.5 0 top
R2  44,81.5 0 top
R3  39.5,81.5 0 top
R4  30.5,81.5 0 top
R5  26,81.5 0 top
R6  35,81.5 180 top
R7  15.5,33.75 270 top
R8  40.62,25.25 270 top
R9  7.58,37 180 top
R10  48.54,22.88 180 top
R12  16.62,28.25 90 top
RCLOCK  7.88,52.12 180 top
RSHUNT  47.19,44.51 0 top
SE_BYPASS_REG  46,29.5 180 top
SEL_BOOT0  10.12,33.75 0 top
SEL_BOOT1  46,25.25 180 top
SEL_PDR_ON  10.12,29.5 0 top
SEL_VCAP1  46,33.75 180 top
SEL_VCAP2  46,38 180 top
ST_EN_PWR  21.5,77.5 90 top
ST_JTCK/SWCLK  35,77.5 90 top
ST_JTDI  44,77.5 90 top
ST_JTDO  30.5,77.5 90 top
ST_JTMS/SWDIO  39.5,77.5 90 top
ST_JTRST  48.5,77.5 90 top
ST_NRST  26,77.5 90 top
STLINK_V2  35,87.5 180 top
U1  28,29 0 top
U$1  [1234_MULTI-LAYER_PCB-INSPECTION]  60.5,46 90 top  (outside the outline)
U$2  [GITHUB_ARCADEHUSLE_PROJECTLITTLEMAN_2_BOTTOM_45MM]  28,5.5 0 top
U$3  [GITHUB_ARCADEHUSLE_PROJECTLITTLEMAN_2_TOP_45MM]  28,46.67 0 top
U$4  [CE_ICON_6MM]  40,67.27 0 bottom
U$5  [WEEE_ICON_6MM]  28,67.27 0 bottom
U$6  [ROHS3_COMPLIANT_ICON_6MM-8.98MM]  14,67.27 0 bottom
U$8  [ICON_CC-BY-NC-SA-4.0_H=8.7MM]  28,60.81 0 bottom
VDD  35.62,44.58 270 bottom
VSS  28,44.58 270 bottom

### Tracks (layer width: path | path; a pad name or v marks a point on that pad's centre or on a via)
3.3V  (via drill 0.2, 0.3)
  TOP(SIGNAL) 0.152: U1.F4 25.6,29 22.93,29 | U1.F10 31.2,29.8 32.8,29.8 33.1,29.5 33.1,29.4 | C1.1 34.58,28.5 34.5,28.5 | C2.1 36.23,28.48 36.23,28.5 | C6.1 34.5,32.2 32,32.2 U1.C11 | U1.D3 24.8,31.4 24.8,34.1
  TOP(SIGNAL) 0.35: U1.F5 U1.F4 26.4,29.4 26.4,29 | U1.F5 U1.F6 | U1.F6 U1.F7 | U1.F7 U1.F8 | U1.F8 U1.F9 U1.F10 | U1.G5 U1.F5 | U1.G5 U1.G6 | U1.G6 U1.F6 | U1.G6 U1.G7 | U1.G7 U1.F7 | 28,29.4 U1.F7 | 29.6,29.4 U1.F8 | 28,28.6 U1.G7 | 27.2,28.6 U1.G5
  TOP(SIGNAL) 0.5: 22.93,29 22.43,28.49 | v37.12,28.5 36.23,28.5 v35.44,28.5 34.5,28.5 34.38,28.62 33.88,28.62 33.1,29.4 | 22.43,28.49 22.43,25.5 23.32,24.6 U1.M1 | 22.43,28.49 22.43,28.5 v18.75,28.5 | 24.8,34.1 24.8,35.2 C5.1 v25.6,36.86 | C3.1 20.95,28.5 v20.44,28.5 19.93,28.5 C4.1 19.32,28.5 v18.75,28.5 | C6.1 v34.6,33.16 | R5.2 v27.62,81.5 | R4.2 v32.12,81.5 | R3.2 v41.12,81.5 | R2.2 v45.62,81.5 | R1.2 v50.12,81.5 | R9.2 v5.94,37 | R10.2 47.72,22.9 v46.9,22.9 | R12.2 17.95,29.05 18.5,28.5 v18.75,28.5
  TOP(SIGNAL) 1: STLINK_V2.2 STLINK_V2.1
  pour PWR (isolate 0.152): 0,0 56,0 56,92 0,92
  pour TOP(SIGNAL) (isolate 0.152, no thermals): 25.6,28.99 25.6,29.9 30.55,29.9 30.9,29.55 30.9,29.35 30.65,29.1 29.04,29.1 28.04,28.1 27.1,28.1 26.21,28.99
BOOT0  (via drill 0.2)
  TOP(SIGNAL) 0.089: 10.14,33.62 17.47,40.95 BOOT0.1 19.11,40.45 22.6,36.96 22.6,31.3 23.3,30.6 26.1,30.6 26.4,30.6 U1.D5 v27.2,30.6 | K1.17 3.68,16.57 2.25,18 2.25,32.25 3.1,33.1 4.65,33.1 5.75,32 8.5,32 SEL_BOOT0.2
  TOP(SIGNAL) 0.127: SEL_BOOT0.2 10.14,33.62
  BOTTOM(SIGNAL) 0.089: v27.2,30.6 28.7,29.1 28.7,27 29.1,26.6 32.8,26.6 33.7,25.7 33.7,8.17 K2.11
BOOT1
  TOP(SIGNAL) 0.089: U1.J5 26.4,26.6 26.4,23.23 BOOT1.1 29.73,19.9 34.38,19.9 40.52,19.9 SEL_BOOT1.2 | K2.13 34.35,19.88
  TOP(SIGNAL) 0.127: 34.35,19.88 34.38,19.9
BYPASS_REG
  TOP(SIGNAL) 0.089: SE_BYPASS_REG.2 43.75,27.38 40.38,27.38
  TOP(SIGNAL) 0.127: U1.H5 27.2,27.4 27.2,24.1 28,23.3 28.86,23.3 BYPASS_REG.1 34.62,21.62 40.38,27.38
CLKI  (via drill 0.2)
  TOP(SIGNAL) 0.089: v11.6,36.8 11.6,49.2 RCLOCK.1
  TOP(SIGNAL) 0.127: U1.D1 23.5,31 v23.1,31.4
  BOTTOM(SIGNAL) 0.089: v23.1,31.4 17,31.4 v11.6,36.8
GND  (via drill 0.2, 0.3)
  TOP(SIGNAL) 0.35: U1.D2 v24,31.4 | U1.G4 v26.4,28.2 | U1.H6 v28,27.4 | U1.G8 v29.6,28.2 | U1.G10 v31.2,29 | U1.E6 v28,30.6 U1.E7 v28.8,30.6 | U1.J1 v24,26.6
  TOP(SIGNAL) 0.5: 21.41,29.5 v22.12,29.5 21.2,29.5 | v18.75,29.5 19.57,29.5 | 19.57,29.5 v20.44,29.5 21.2,29.5 | C3.2 21.25,29.55 21.2,29.5 | C4.2 19.62,29.55 19.57,29.5 | C6.2 36.06,32.44 v36.06,33.16 | C5.2 27.1,36.1 v27.1,36.86 | C7.2 v21.8,36.86 | R6.1 v36.62,81.5 | C11.2 41.46,34.55 v41.48,34.56 | C10.2 41.46,38.8 v41.48,38.81 | R8.1 41.49,26.05 v41.5,26.06 | R7.1 14.64,34.55 v14.62,34.56
  TOP(SIGNAL) 1: C8.2 C9.2 51.36,41.33 K3.7
  BOTTOM(SIGNAL) 1: STLINK_V2.20 STLINK_V2.18 STLINK_V2.16 STLINK_V2.14 STLINK_V2.12 STLINK_V2.10 STLINK_V2.8 STLINK_V2.6 STLINK_V2.4
  other vias: 35.44,30.25 33.75,30.25 37.12,30.25 32.25,80.88 27.75,80.88 36.75,80.88 41.25,80.88 45.75,80.88 50.25,80.88 25.6,33 23.3,34.7 32.8,31.4 11.2,36.3 32,25.8 32,24.2 46.8,22.26 34.6,25.2 28,33 30.4,33 31.2,32.2 10.9,14.8 12.1,14.8 13.3,14.8 9.7,14.8 14.5,14.8 21.6,43.36 20.4,34.96 23.1,43.06 24.4,46.16 26.6,46.66 31.8,45.66 33.9,43.16 19.2,45.86 23.05,77.47 27.65,77.47 32.15,77.47 36.65,76.97 41.15,76.97 45.65,76.97 50.15,76.97
  pour GND1 (no thermals): 56,0 56,92 0,92 0,0
  pour TOP(SIGNAL) (rank 6, no thermals): 56,0 56,92 0,92 0,0
  pour BOTTOM(SIGNAL) (rank 6, no thermals): 0,0 0,92 56,92 56,0
GPIO3  (via drill 0.2)
  TOP(SIGNAL) 0.089: U1.A1 23.3,33.7 v23.3,34.1
  BOTTOM(SIGNAL) 0.089: K1.9 3.75,36.9 3.8,36.9 5.4,38.5 12.5,38.5 18,33 22.2,33 v23.3,34.1
GPIO4  (via drill 0.2)
  TOP(SIGNAL) 0.127: U1.C9 29.6,32.2 v25.6,32.2
  BOTTOM(SIGNAL) 0.089: K1.10 4.35,34.35 7.75,37.75 12.25,37.75 17.75,32.25
  BOTTOM(SIGNAL) 0.127: 17.75,32.25 25.55,32.25 v25.6,32.2
INTERNAL_RST
  TOP(SIGNAL) 0.089: U1.J2 24.8,26.6 24.8,22.29 INT_RST.1 24.38,21.62 17.75,28.25 15.75,28.25 12.75,25.25 EN_INT_RST.1
JTCK/SWDCLK  (via drill 0.2)
  TOP(SIGNAL) 0.089: JTCK/SWCLK.1 31.6,43.1 U1.A11 v31.2,33 | v13.9,14.8 13.9,6.67 K2.6
  BOTTOM(SIGNAL) 0.089: v31.2,33 29.3,31.1 26.6,31.1 13.9,18.4 v13.9,14.8 | JTCK/SWCLK.1 33.08,60.98 46.2,74.1 46.2,77.1 45.8,77.5 36.4,77.5 ST_JTCK/SWCLK.1
JTDI  (via drill 0.2)
  TOP(SIGNAL) 0.089: JTDI.1 29.53,43.57 29.53,35.47 30.4,34.6 v30.4,33.8 U1.A10 | v12.7,14.8 12.7,3 12.2,2.5 10.19,2.5 K2.3
  BOTTOM(SIGNAL) 0.089: v30.4,33.8 28.1,31.5 26.5,31.5 12.7,17.7 v12.7,14.8 | JTDI.1 30.54,62.64 ST_JTDI.1
JTDO  (via drill 0.2)
  TOP(SIGNAL) 0.089: JTDO/SWO.1 21.68,45.88 23.63,45.88 24.23,45.28 24.23,43.85 24.9,43.18 27.8,43.18 28.7,42.28 28.7,33.7 U1.A7 v28.8,33 | v11.5,14.8 K2.4
  BOTTOM(SIGNAL) 0.089: v28.8,33 27.7,31.9 26.4,31.9 11.5,17 v11.5,14.8 | JTDO/SWO.1 20.38,65.98 ST_JTDO.1
JTMS/SWDIO  (via drill 0.2)
  TOP(SIGNAL) 0.089: JTMS/SWDIO.1 27.06,46.18 33.57,46.18 34.37,45.38 34.37,35.37 U1.A12 v32,33
  BOTTOM(SIGNAL) 0.089: v32,33 32,32.2 29.1,29.3 29.1,27.2 29.34,26.96 33.14,26.96 34.1,26 34.1,24.3 35.6,22.8 35.6,2.6 34.8,1.8 15.97,1.8 K2.5 | JTMS/SWDIO.1 25.46,62.06 ST_JTMS/SWDIO.1
LED1  (via drill 0.2)
  TOP(SIGNAL) 0.089: U1.H9 v29.6,27.4
  BOTTOM(SIGNAL) 0.089: v29.6,27.4 33.7,27.4 35.95,25.15 36,25.1 47.07,14.03
  BOTTOM(SIGNAL) 0.127: 47.07,14.03 K3.18
LED2  (via drill 0.2)
  TOP(SIGNAL) 0.089: U1.K12 32.8,25.8 v34.6,25.8
  BOTTOM(SIGNAL) 0.089: 49.01,11.49 34.7,25.8
  BOTTOM(SIGNAL) 0.127: 49.01,11.49 K3.19 | v34.6,25.8 34.7,25.8
LED3  (via drill 0.2)
  TOP(SIGNAL) 0.089: U1.F12 v32,29
  BOTTOM(SIGNAL) 0.089: v32,29 32.7,29 46.4,15.3
  BOTTOM(SIGNAL) 0.127: K3.20 53.8,10.49 53.8,14.4 52.9,15.3 46.4,15.3
N$1
  TOP(SIGNAL) 0.127: R2.1 43.2,84.55 42.62,85.12 42.62,87.58 STLINK_V2.5
  TOP(SIGNAL) 0.3: ST_JTDI.2 43.2,79.7 R2.1
N$2
  TOP(SIGNAL) 0.127: U1.C2 24,32.2 24,34.1
  TOP(SIGNAL) 0.5: C7.1 24,35.4 24,34.1
  TOP(SIGNAL) 0.8: C7.1 23.4,38.89 EN_VBAT.1
N$3
  TOP(SIGNAL) 0.089: PWR.ANODE 20.88,21.49 20.88,23.25 16.68,27.45
  TOP(SIGNAL) 0.127: 16.68,27.45 R12.1
N$4
  TOP(SIGNAL) 0.127: R3.1 38.7,83.99 37.56,85.12 37.56,87.6 STLINK_V2.7
  TOP(SIGNAL) 0.3: ST_JTMS/SWDIO.2 38.7,79.7 R3.1
N$5
  TOP(SIGNAL) 0.5: C10.1 42.79,37.2 SEL_VCAP2.3
N$6
  TOP(SIGNAL) 0.127: R1.1 45.19,84.01 45.19,87.55 STLINK_V2.3
  TOP(SIGNAL) 0.3: ST_JTRST.2 47.7,79.7 R1.1
N$7
  TOP(SIGNAL) 0.127: R6.2 34.2,84.33 35,85.12 35,87.58 STLINK_V2.9
  TOP(SIGNAL) 0.3: ST_JTCK/SWCLK.2 34.2,79.7 R6.2
N$8
  TOP(SIGNAL) 0.5: R7.2 13.59,32.95 SEL_BOOT0.3
N$9
  TOP(SIGNAL) 0.127: R4.1 29.7,84.95 29.88,85.12 29.88,87.53 STLINK_V2.13
  TOP(SIGNAL) 0.3: ST_JTDO.2 29.7,79.7 R4.1
N$10
  TOP(SIGNAL) 0.5: R10.1 49.34,24.32 SEL_BOOT1.1
N$11
  TOP(SIGNAL) 0.127: R5.1 25.2,82.83 27.38,85 27.38,87.58 STLINK_V2.15
  TOP(SIGNAL) 0.3: ST_NRST.2 25.2,79.7 R5.1
N$12
  TOP(SIGNAL) 0.5: R8.2 42.79,24.45 SEL_BOOT1.3
N$13
  TOP(SIGNAL) 1: ST_EN_PWR.2 21.5,86.78 STLINK_V2.19
N$14
  TOP(SIGNAL) 0.5: C11.1 42.79,32.95 SEL_VCAP1.3
N$15
  TOP(SIGNAL) 0.5: R9.1 8.38,34.68 SEL_BOOT0.1
N$18
  TOP(SIGNAL) 0.127: K3.8 53.62,38.06 53.62,33.43 K3.11
N$19
  TOP(SIGNAL) 0.089: RCLOCK.2 K1.3
NJRST  (via drill 0.2)
  TOP(SIGNAL) 0.089: NJRST.1 22.92,44.16 24.5,42.58 27.4,42.58 28.1,41.88 28.1,34.5 27.6,34 U1.A6 v27.2,33 | v10.3,14.8 10.3,7.89 K2.2
  BOTTOM(SIGNAL) 0.089: v27.2,33 27,33 10.3,16.3 v10.3,14.8 | NJRST.1 24.8,42.7 36.2,42.7 48.5,55 ST_JTRST.1
NRST
  TOP(SIGNAL) 0.089: U1.F1 23.23,29.4 21.12,31.5 19.12,31.5 | 8.75,25.25 10.75,27.25 13,27.25 17.25,31.5 19.12,31.5 | 19.12,35.85 19.12,31.5 | 3.74,31.76 5.5,30 5.5,28.5 8.73,25.27 | EN_INT_RST.2 8.73,11.43 2.2,4.9 2.2,2.4 3.1,1.5 19.15,1.5 K2.8
  TOP(SIGNAL) 0.127: 8.75,25.25 EN_INT_RST.2 8.73,25.27 | NRST.1 19.12,35.85 | K1.11 3.74,31.76
  BOTTOM(SIGNAL) 0.089: NRST.1 16.3,38.68 16.3,66.4 ST_NRST.1
PDR_ON
  TOP(SIGNAL) 0.089: U1.E5 26.4,29.8 23.4,29.8 20.85,32.35 20.85,36.67 PDR_ON.1 | SEL_PDR_ON.2 12.5,31.75 16.25,31.75 17.25,32.75 17.25,36.5 19.11,38.36
  TOP(SIGNAL) 0.127: SEL_PDR_ON.2 | 19.11,38.36 PDR_ON.1
SHUNTH
  TOP(SIGNAL) 0.5: K3.6 52,44.76 K3.5 50.5,48.55 50.5,50.63 K3.3
  TOP(SIGNAL) 0.95: K3.6 RSHUNT.2 48,44.5 C8.1 C9.1
SHUNTL
  TOP(SIGNAL) 1: SEL_VCAP1.1 SEL_VCAP2.1 48.54,38.5 46.39,40.65 RSHUNT.1 46.39,50.17 50.88,54.67 K3.2
SPI_CS  (via drill 0.2)
  TOP(SIGNAL) 0.127: U1.M11 v31.2,24.2
  BOTTOM(SIGNAL) 0.089: 4,14 7.5,10.5 26,10.5 33,17.5 33,22.4 v31.2,24.2
  BOTTOM(SIGNAL) 0.127: 4,14 K1.18
SPI_MISO  (via drill 0.2)
  TOP(SIGNAL) 0.089: U1.L11 v31.2,25.8
  BOTTOM(SIGNAL) 0.089: K1.13 6.25,24.22 6.25,14.75 8.5,12.5 25,12.5 29.25,16.75 29.25,24 31.05,25.8 v31.2,25.8
SPI_MOSI  (via drill 0.2)
  TOP(SIGNAL) 0.089: U1.L12 v32.8,25
  BOTTOM(SIGNAL) 0.089: K1.14 5.25,22.94 5.25,14.25 8,11.5 25.5,11.5 32,18 32,22 30.5,23.5 30.5,24.5 31,25 v32.8,25
SPI_SCK  (via drill 0.2)
  TOP(SIGNAL) 0.089: U1.M12 v32.8,24.2
  BOTTOM(SIGNAL) 0.089: K1.12 7.25,26.02 7.25,15.25 9,13.5 24.5,13.5 26.75,15.75 26.75,22.5 30.49,26.24 32.46,26.24 33.3,25.4 33.3,24.7 v32.8,24.2
UART_RX  (via drill 0.2)
  TOP(SIGNAL) 0.089: U1.D11 v32,31.4
  BOTTOM(SIGNAL) 0.089: K1.8 4.18,39.25 12.75,39.25 18.25,33.75 21.35,33.75 22.8,35.2 31.1,35.2 33.1,33.2 33.1,32.5 v32,31.4
UART_TX  (via drill 0.2)
  TOP(SIGNAL) 0.089: 32.46,30.94 33.26,30.94 v33.3,30.9
  TOP(SIGNAL) 0.127: U1.D12 32.46,30.94
  BOTTOM(SIGNAL) 0.089: v33.3,30.9 33.7,31.3 33.7,33.6 31.4,35.9 22.4,35.9 21,34.5 18.5,34.5 11.03,41.97 K1.7
VCAP1
  TOP(SIGNAL) 0.152: U1.H7 28.8,27.4 28.8,26.76 28.96,26.6 33.08,26.6
  TOP(SIGNAL) 0.5: 33.08,26.6 37.97,26.6 43,31.63 44,31.63 46,33.63 SEL_VCAP1.2
VCAP2
  TOP(SIGNAL) 0.152: U1.G9 30.4,28.2 30.4,27.56 30.56,27.4 33.02,27.4
  TOP(SIGNAL) 0.5: SEL_VCAP2.2 46,37.75 44.12,35.88 39.75,35.88 38.62,34.75 38.62,28.75 37.27,27.4 33.02,27.4

### Text on the board
tPlace: 3.3VDC | STM32F446ZEJx-SW308-UFO V1.0 | STM32F4 UFBGA144 (10x10mm) Target | For ChipWhisperer CW308 UFO Board
bPlace: JLCJLCJLC